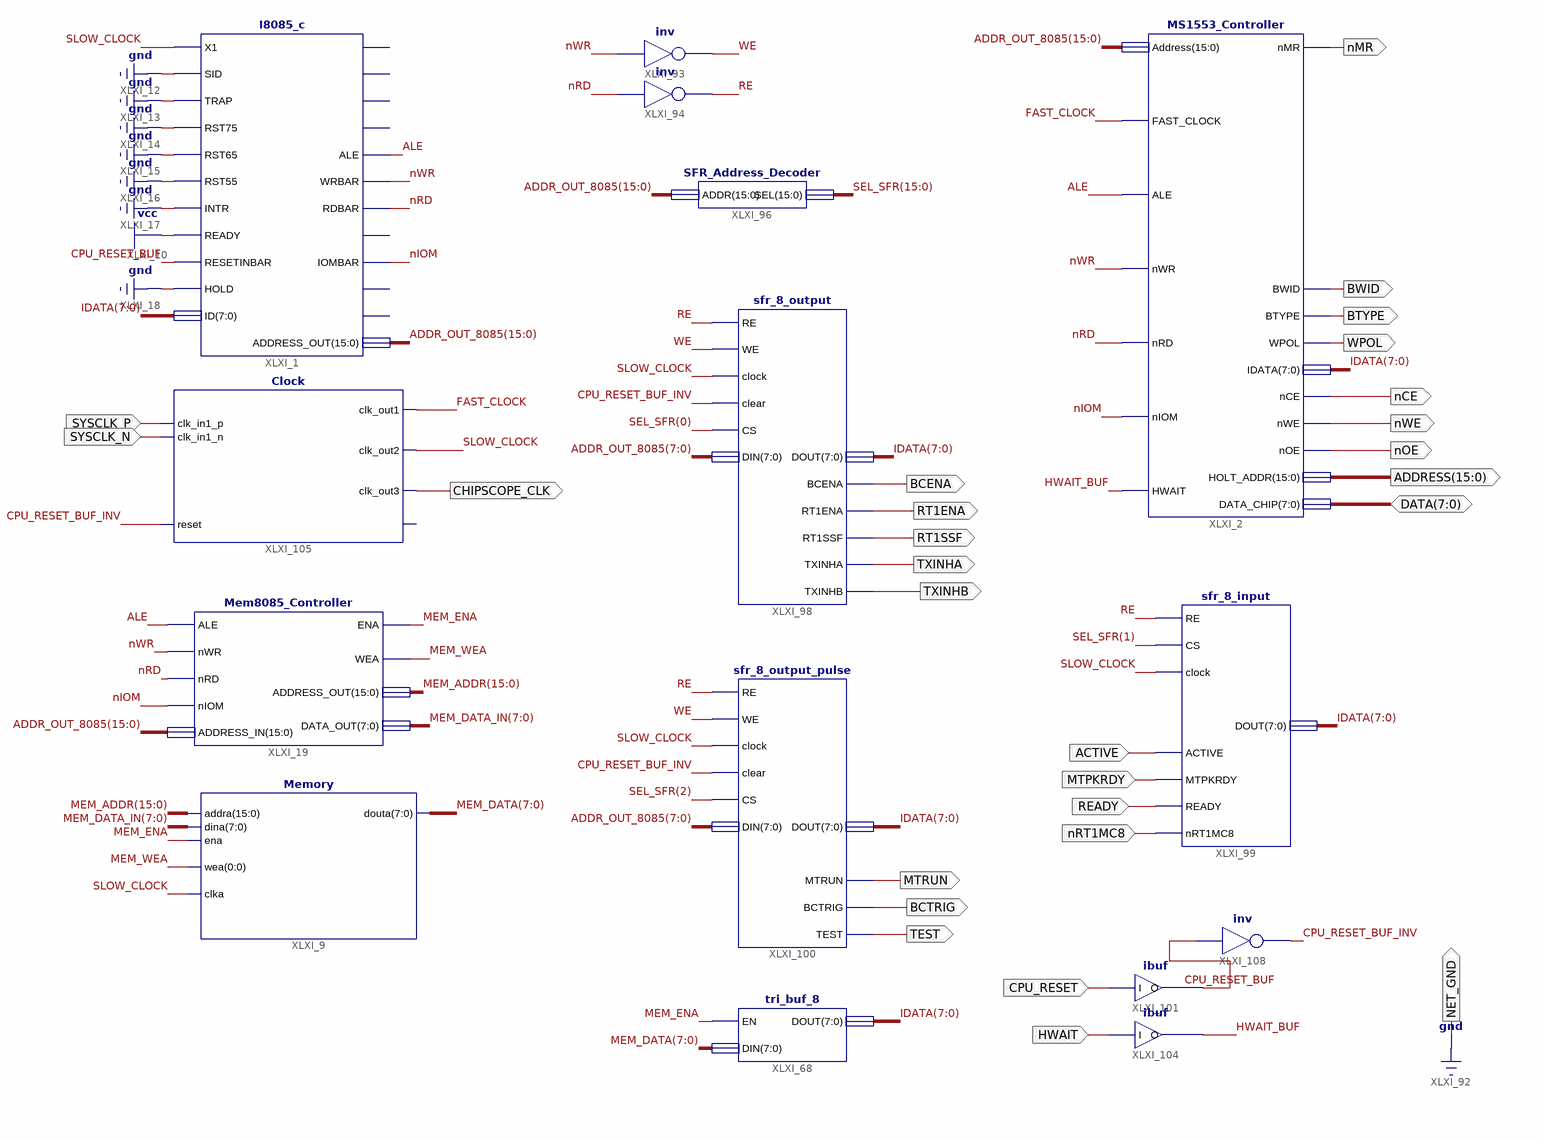
[diagram p0: schematic sheet 1]
// Xilinx ISE schematic System.sch (spartan6) as structural Verilog: 15 symbols, 27 ports
module System (
  input  SYSCLK_P,
  input  SYSCLK_N,
  input  ACTIVE,
  input  MTPKRDY,
  input  READY,
  input  nRT1MC8,
  input  CPU_RESET,
  input  HWAIT,
  inout  [7:0] DATA,
  output nMR,
  output BWID,
  output BTYPE,
  output WPOL,
  output nCE,
  output nWE,
  output nOE,
  output [15:0] ADDRESS,
  output NET_GND,
  output CHIPSCOPE_CLK,
  output MTRUN,
  output BCTRIG,
  output TEST,
  output BCENA,
  output RT1ENA,
  output RT1SSF,
  output TXINHA,
  output TXINHB
);

  wire ALE, CPU_RESET_BUF, CPU_RESET_BUF_INV, FAST_CLOCK, HWAIT_BUF, MEM_ENA, MEM_WEA, nIOM, nRD, nWR, RE,
       SLOW_CLOCK, WE;
  wire [7:0] IDATA, MEM_DATA, MEM_DATA_IN;
  wire [15:0] ADDR_OUT_8085, MEM_ADDR, SEL_SFR;

  MS1553_Controller XLXI_2 (
    .Address(ADDR_OUT_8085), .FAST_CLOCK(FAST_CLOCK), .ALE(ALE), .nWR(nWR), .nRD(nRD), .nIOM(nIOM),
    .HWAIT(HWAIT_BUF), .DATA_CHIP(DATA), .nMR(nMR), .BWID(BWID), .BTYPE(BTYPE), .WPOL(WPOL), .IDATA(IDATA),
    .nCE(nCE), .nWE(nWE), .nOE(nOE), .HOLT_ADDR(ADDRESS));
  I8085_c XLXI_1 (
    .X1(SLOW_CLOCK), .SID(1'b0), .TRAP(1'b0), .RST75(1'b0), .RST65(1'b0), .RST55(1'b0), .INTR(1'b0),
    .READY(1'b1), .RESETINBAR(CPU_RESET_BUF), .HOLD(1'b0), .ID(IDATA), .ALE(ALE), .WRBAR(nWR), .RDBAR(nRD),
    .IOMBAR(nIOM), .ADDRESS_OUT(ADDR_OUT_8085));  // open: RESETOUT, SOD, INTABAR, S0, S1, CLKOUT, HLDA
  Mem8085_Controller XLXI_19 (
    .ALE(ALE), .nWR(nWR), .nRD(nRD), .nIOM(nIOM), .ADDRESS_IN(ADDR_OUT_8085), .ENA(MEM_ENA), .WEA(MEM_WEA),
    .ADDRESS_OUT(MEM_ADDR), .DATA_OUT(MEM_DATA_IN));
  not XLXI_93 (WE, nWR);
  not XLXI_94 (RE, nRD);
  SFR_Address_Decoder XLXI_96 (.ADDR(ADDR_OUT_8085), .SEL(SEL_SFR));
  sfr_8_output XLXI_98 (
    .RE(RE), .WE(WE), .clock(SLOW_CLOCK), .clear(CPU_RESET_BUF_INV), .CS(SEL_SFR[0]),
    .DIN(ADDR_OUT_8085[7:0]), .DOUT(IDATA), .BCENA(BCENA), .RT1ENA(RT1ENA), .RT1SSF(RT1SSF), .TXINHA(TXINHA),
    .TXINHB(TXINHB));
  sfr_8_output_pulse XLXI_100 (
    .RE(RE), .WE(WE), .clock(SLOW_CLOCK), .clear(CPU_RESET_BUF_INV), .CS(SEL_SFR[2]),
    .DIN(ADDR_OUT_8085[7:0]), .MTRUN(MTRUN), .BCTRIG(BCTRIG), .TEST(TEST), .DOUT(IDATA));
  Clock XLXI_105 (
    .clk_in1_p(SYSCLK_P), .clk_in1_n(SYSCLK_N), .clk_out1(FAST_CLOCK), .clk_out2(SLOW_CLOCK),
    .clk_out3(CHIPSCOPE_CLK), .reset(CPU_RESET_BUF_INV));  // open: locked
  sfr_8_input XLXI_99 (
    .RE(RE), .CS(SEL_SFR[1]), .clock(SLOW_CLOCK), .DOUT(IDATA), .ACTIVE(ACTIVE), .MTPKRDY(MTPKRDY),
    .READY(READY), .nRT1MC8(nRT1MC8));
  ibuf XLXI_101 (.I(CPU_RESET), .O(CPU_RESET_BUF));
  ibuf XLXI_104 (.I(HWAIT), .O(HWAIT_BUF));
  not XLXI_108 (CPU_RESET_BUF_INV, CPU_RESET_BUF);
  tri_buf_8 XLXI_68 (.EN(MEM_ENA), .DIN(MEM_DATA), .DOUT(IDATA));
  Memory XLXI_9 (
    .addra(MEM_ADDR), .dina(MEM_DATA_IN), .ena(MEM_ENA), .wea(MEM_WEA), .clka(SLOW_CLOCK), .douta(MEM_DATA));

  assign NET_GND = 1'b0;
endmodule
